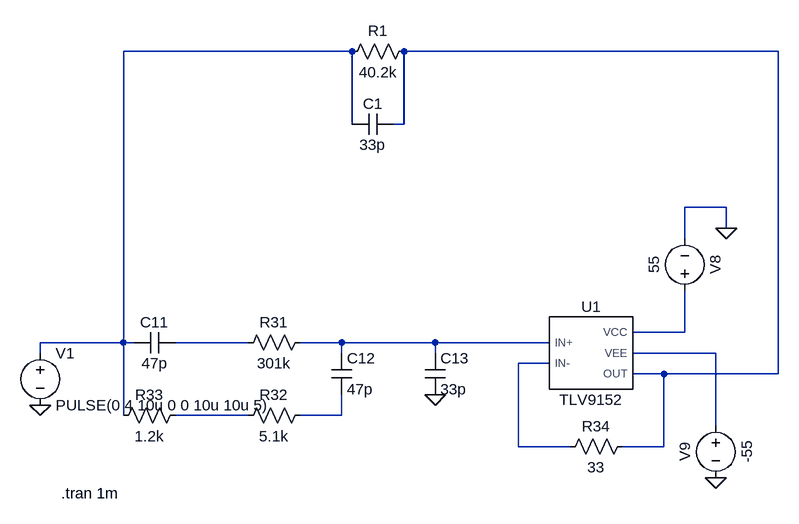
[diagram p0: schematic буфер 1 тест.asc]
буфер 1 тест.asc, the LTspice schematic file:
Version 4
SHEET 1 2548 1624
WIRE 1872 80 1520 80
WIRE 2528 80 1952 80
WIRE 1872 192 1872 80
WIRE 1952 192 1952 80
WIRE 1952 192 1936 192
WIRE 2448 320 2384 320
WIRE 2448 352 2448 320
WIRE 2384 368 2384 320
WIRE 2384 512 2384 448
WIRE 2384 512 2304 512
WIRE 1520 528 1520 80
WIRE 1520 528 1392 528
WIRE 1536 528 1520 528
WIRE 1712 528 1600 528
WIRE 1856 528 1792 528
WIRE 2000 528 1856 528
WIRE 2176 528 2000 528
WIRE 1392 544 1392 528
WIRE 1856 544 1856 528
WIRE 2000 544 2000 528
WIRE 2432 544 2304 544
WIRE 2176 560 2128 560
WIRE 2352 576 2304 576
WIRE 2528 576 2528 80
WIRE 2528 576 2352 576
WIRE 1520 640 1520 528
WIRE 1712 640 1600 640
WIRE 1856 640 1856 608
WIRE 1856 640 1792 640
WIRE 2432 656 2432 544
WIRE 2128 688 2128 560
WIRE 2208 688 2128 688
WIRE 2352 688 2352 576
WIRE 2352 688 2288 688
FLAG 2000 608 0
FLAG 2432 736 0
FLAG 2448 352 0
FLAG 1392 624 0
SYMBOL cap 1600 512 R90
WINDOW 0 0 32 VBottom 2
WINDOW 3 32 32 VTop 2
SYMATTR InstName C11
SYMATTR Value 47p
SYMBOL res 1808 512 R90
WINDOW 0 0 56 VBottom 2
WINDOW 3 32 56 VTop 2
SYMATTR InstName R31
SYMATTR Value 301k
SYMBOL res 1808 624 R90
WINDOW 0 0 56 VBottom 2
WINDOW 3 32 56 VTop 2
SYMATTR InstName R32
SYMATTR Value 5.1k
SYMBOL res 1616 624 R90
WINDOW 0 0 56 VBottom 2
WINDOW 3 32 56 VTop 2
SYMATTR InstName R33
SYMATTR Value 1.2k
SYMBOL cap 1840 544 R0
SYMATTR InstName C12
SYMATTR Value 47p
SYMBOL cap 1984 544 R0
SYMATTR InstName C13
SYMATTR Value 33p
SYMBOL res 2304 672 R90
WINDOW 0 0 56 VBottom 2
WINDOW 3 32 56 VTop 2
SYMATTR InstName R34
SYMATTR Value 33
SYMBOL voltage 2384 464 M180
WINDOW 0 32 56 VTop 2
WINDOW 3 -32 56 VBottom 2
WINDOW 123 0 0 Left 0
WINDOW 39 0 0 Left 0
SYMATTR InstName V8
SYMATTR Value 55
SYMBOL voltage 2432 640 M0
WINDOW 0 32 56 VTop 2
WINDOW 3 -32 56 VBottom 2
WINDOW 123 0 0 Left 0
WINDOW 39 0 0 Left 0
SYMATTR InstName V9
SYMATTR Value -55
SYMBOL TLV9152 2240 544 R0
SYMATTR InstName U1
SYMBOL voltage 1392 528 R0
WINDOW 123 0 0 Left 0
WINDOW 39 0 0 Left 0
SYMATTR InstName V1
SYMATTR Value PULSE(0 4 10u 0 0 10u 10u 5)
SYMBOL res 1968 64 R90
WINDOW 0 0 56 VBottom 2
WINDOW 3 32 56 VTop 2
SYMATTR InstName R1
SYMATTR Value 40.2k
SYMBOL cap 1936 176 R90
WINDOW 0 0 32 VBottom 2
WINDOW 3 32 32 VTop 2
SYMATTR InstName C1
SYMATTR Value 33p
TEXT 1424 760 Left 2 !.tran 1m

The netlist it stands for:
* буфер 1 тест.asc
C11 N004 N001 47p
R31 N005 N004 301k
R32 N009 N008 5.1k
R33 N008 N001 1.2k
C12 N005 N009 47p
C13 N005 0 33p
R34 N002 N007 33
V8 N003 0 55
V9 N006 0 -55
XU1 N005 N007 N003 N006 N002 TLV9152  ; pins IN+ IN- VCC VEE OUT
V1 N001 0 PULSE(0 4 10u 0 0 10u 10u 5)
R1 N002 N001 40.2k
C1 N002 N001 33p
.tran 1m
.lib ./tlv9152.lib
.backanno
.end